# EAGLE design rs485_sisaku (EAGLE 9.6.2)
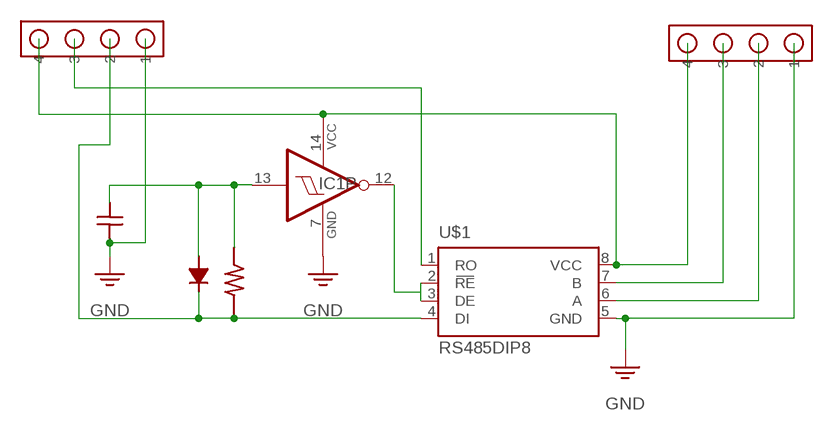
[diagram p0: schematic, sheet 1]

## Parts
IC1  7414N  [DIL14]
U$1  RS485DIP8  [DIP826W53P254L959H508Q8B]
U$2  RESISTOR  [RESISTOR-1/4W]
U$3  DIODE-S  [DIODE-S]
U$5  CAPACITOR-CEL  [100NF]
U$8  EH4  [EH4]
U$9  EH4  [EH4]

## Nets
GND: IC1.7(P:GND) U$1.5(GND) U$5.1 U$8.1 U$9.1
N$1: IC1.12(A:O) U$1.2(RE) U$1.3(DE)
N$2: IC1.13(A:I) U$2.P$2 U$3.1 U$5.2
N$3: IC1.14(P:VCC) U$1.8(VCC) U$8.4 U$9.4
N$4: U$1.4(DI) U$2.P$1 U$3.2 U$8.2
N$5: U$1.1(RO) U$8.3
N$7: U$1.7(B) U$9.3
N$8: U$1.6(A) U$9.2
Unconnected: IC1.1(D:I) IC1.2(D:O) IC1.3(E:I) IC1.4(E:O) IC1.5(F:I) IC1.6(F:O) IC1.8(C:O) IC1.9(C:I) IC1.10(B:O) IC1.11(B:I)

## Library data of the parts
IC1 = 74xx-us:74*14: Hex schmitt trigger INVERTER
U$1 = Mathrax:RS485
U$2 = Mathrax:RESISTOR
U$3 = Mathrax:DIODE
U$5 = Mathrax:CAPACITOR-CEL
U$8 U$9 = Mathrax:EH4

## Board
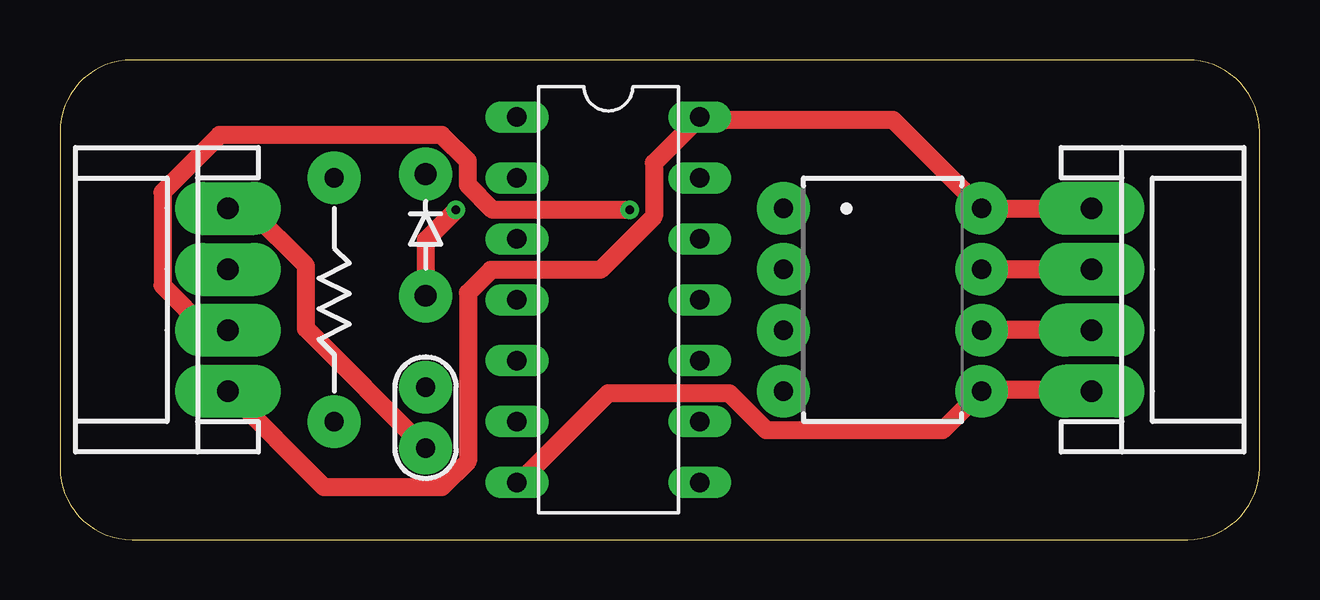
[diagram p1: board, top side]
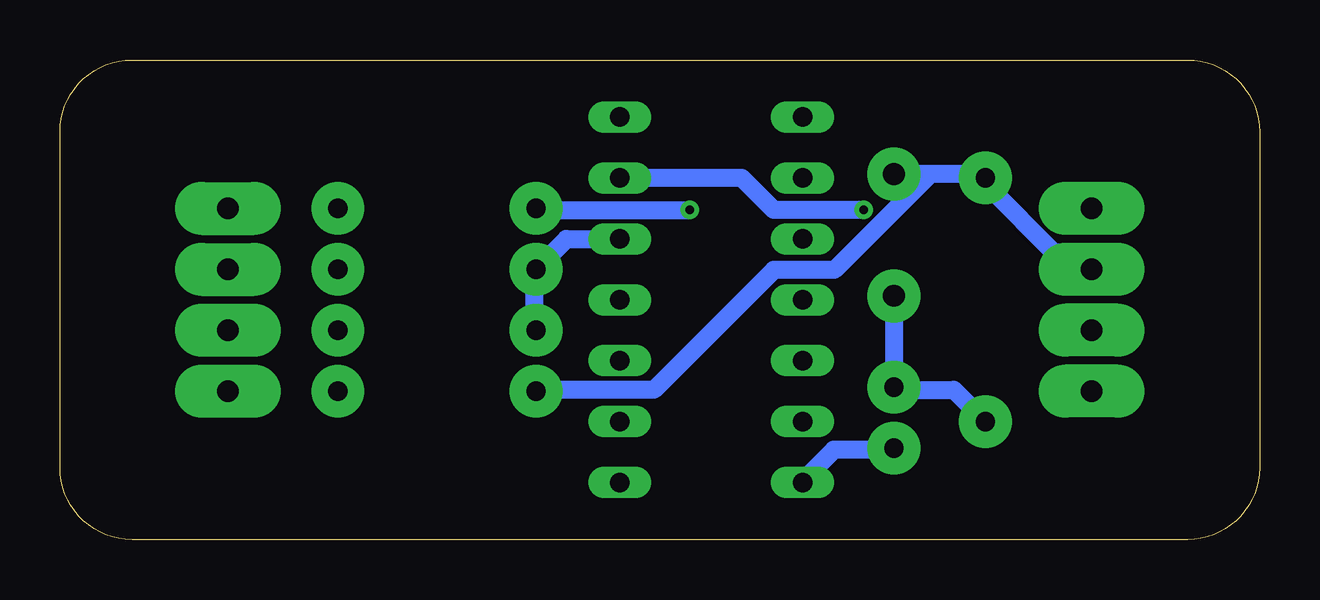
[diagram p2: board, bottom side, seen from below]

Size 50 x 20 mm. Coordinates in mm from the lower left corner, seen from the top.
Outline: 0,17 0,3 arc90 3,0 47,0 arc90 50,3 50,17 arc90 47,20 3,20 arc90 0,17
Copper layers (1*16): Top 0.035mm / dielectric 1.5mm / Bottom 0.035mm
Design rules "default *": minimum track width 0.75mm, minimum drill 0.35mm, track to track 6mil, track to pad 6mil, pad to pad 6mil, via to via 6mil, smd to smd 6mil, copper to edge 40mil, drill to drill 6mil, minimum pad ring 10mil, minimum via ring 8mil, stop-mask expansion 4mil, vias tented up to drill 0mil, thermal gap 10mil

### Footprints (pad centres in the part's own frame; a part is rotated, then mirrored left to right if it is on the bottom)
DIL14 = drill 0.813 long: 1 -7.62,-3.81; 2 -5.08,-3.81; 3 -2.54,-3.81; 4 0,-3.81; 5 2.54,-3.81; 6 5.08,-3.81; 7 7.62,-3.81; 8 7.62,3.81; 9 5.08,3.81; 10 2.54,3.81; 11 0,3.81; 12 -2.54,3.81; 13 -5.08,3.81; 14 -7.62,3.81
DIP826W53P254L959H508Q8B = drill 0.8 pad 2.2: 1 -4.13,3.81; 2 -4.13,1.27; 3 -4.13,-1.27; 4 -4.13,-3.81; 5 4.13,-3.81; 6 4.13,-1.27; 7 4.13,1.27; 8 4.13,3.81
RESISTOR-1/4W = drill 0.8 pad 2.2: P$1 -5.08,0; P$2 5.08,0
DIODE-S = drill 0.9 pad 2.2: 1 -2.54,0; 2 2.54,0
100NF = drill 0.8 pad 2.2: 1 -1.27,0; 2 1.27,0
EH4 = drill 0.9 pad 2.2 long: 1 -3.81,0; 2 -1.27,0; 3 1.27,0; 4 3.81,0

### Placement (x,y rotation side)
IC1  22.86,10 270 top
U$1  34.29,10 0 top
U$2  11.43,10 270 top
U$3  15.24,12.7 90 top
U$5  15.24,5.08 90 top
U$8  7,10 270 top
U$9  43,10 90 top

### Tracks (layer width: path | path; a pad name or v marks a point on that pad's centre or on a via)
GND
  Top 0.75: U$9.1 43,6.25 38.5,6.25 U$1.5 36.79,4.56 29.44,4.56 27.89,6.11 22.86,6.11 19.13,2.38 IC1.7 | U$8.1 7.06,13.75 7.92,13.75 10.25,11.42 10.25,8.8 U$5.1
  Bottom 0.75: IC1.7 19,2.5 17.75,3.75 15.25,3.75 U$5.1
N$1
  Bottom 0.75: U$1.3 30.25,8.75 30.25,11 U$1.2 28.89,12.54 IC1.12
N$2  (via drill 0.35)
  Top 0.75: v16.5,13.75 15.25,12.5 15.25,10.25 U$3.1
  Bottom 0.75: U$2.P$2 11.5,5 12.75,6.25 15,6.25 U$5.2 15.25,6.75 15.25,10 U$3.1 | v16.5,13.75 20.25,13.75 21.58,15.08 IC1.13
N$3
  Top 0.75: U$9.4 U$1.8 34.73,17.5 26.79,17.5 IC1.14 24.75,15.7 24.75,13.47 22.53,11.25 17.96,11.25 17,10.29 17,3.27 15.91,2.18 11.01,2.18 U$8.4
N$4
  Bottom 0.75: 13.75,15.25 15,15.25 U$3.2 | U$1.4 30.1,6.25 25.25,6.25 20.25,11.25 17.72,11.25 13.75,15.22 13.75,15.25 | 13.75,15.25 11.6,15.25 U$2.P$1 11.25,14.9 11.25,14.66 8.59,12 7.73,12 U$8.2
N$5  (via drill 0.35)
  Top 0.75: U$8.3 6.98,8.75 6.12,8.75 4.27,10.6 4.27,14.48 6.66,16.87 15.91,16.87 17,15.78 17,14.79 18.04,13.75 v23.75,13.75
  Bottom 0.75: U$1.1 30.1,13.75 v23.75,13.75
N$7
  Top 0.75: U$9.3 U$1.7
N$8
  Top 0.75: U$9.2 U$1.6